# Altium project RoBeast_Control_Board.PrjPcb (part 3 of 4)

## Sheet RoBeast_Driver.SchDoc: Stepper Motor Drivers
size A4; ApprovedBy: CR; DrawnBy: VM & IG; Revision: V1; SheetNumber: 4; SheetTotal: 9
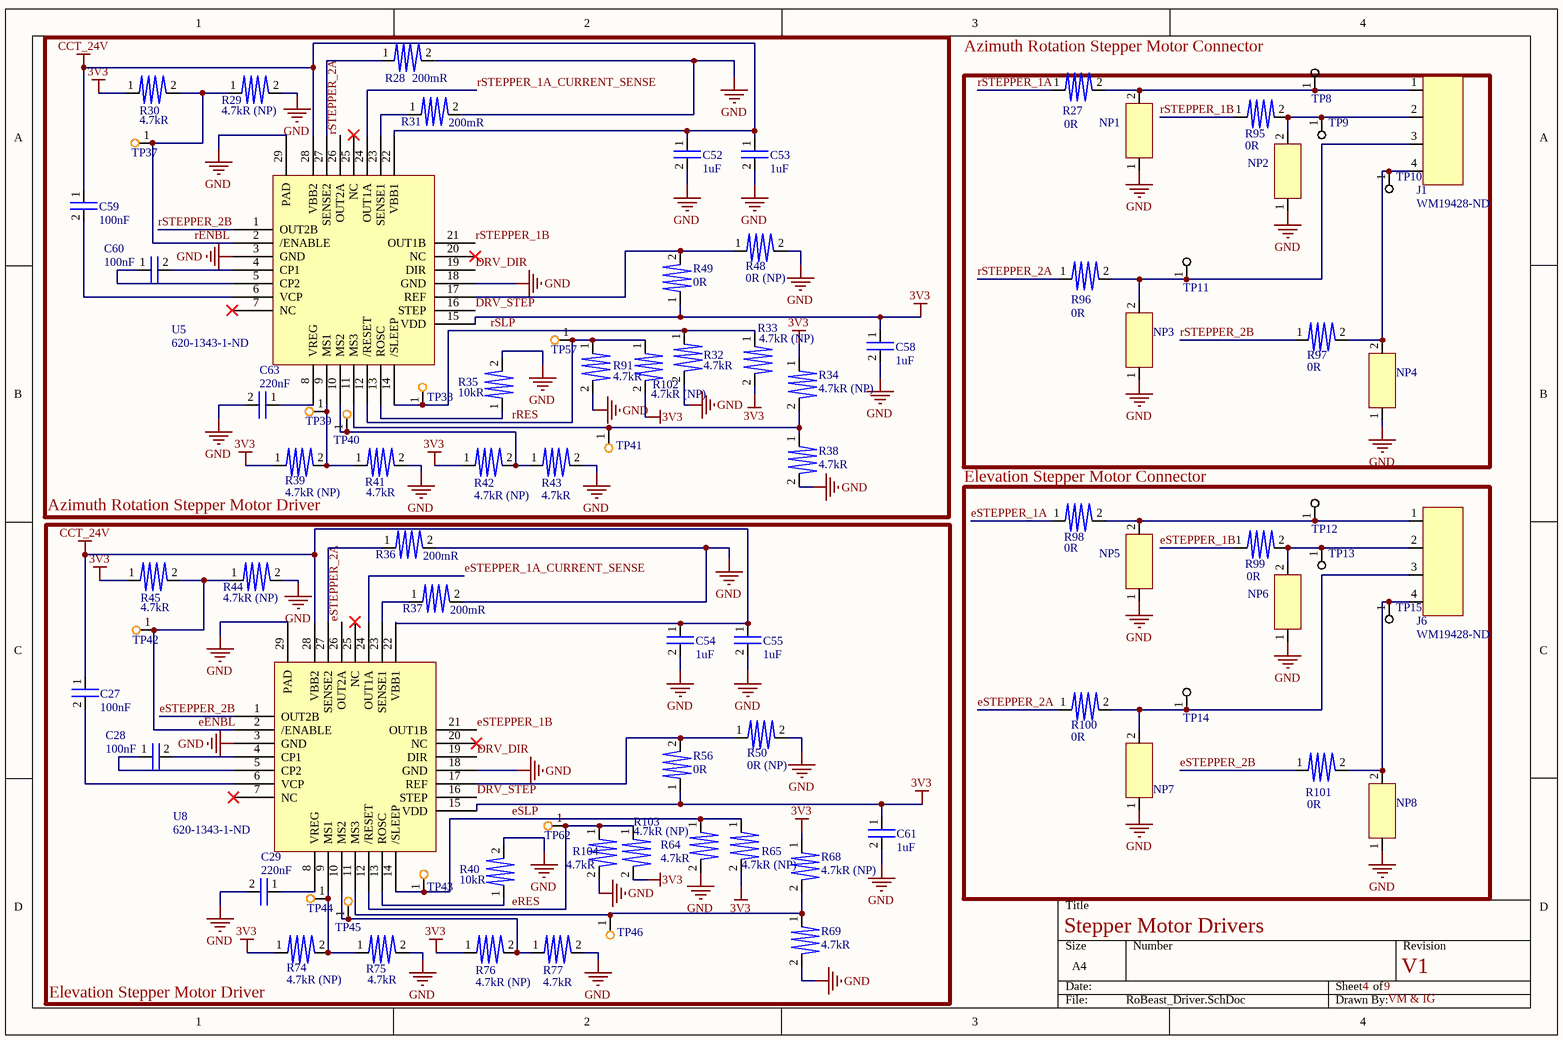
[diagram p3: RoBeast_Driver.SchDoc]

### Parts
C27  100nF  [0805]
C28  100nF  [0805]
C29  220nF  [0805]
C52  1uF  [0805]
C53  1uF  [0805]
C54  1uF  [0805]
C55  1uF  [0805]
C58  1uF  [0805]
C59  100nF  [0805]
C60  100nF  [0805]
C61  1uF  [0805]
C63  220nF  [0805]
J1  Supplier Part Number: WM19428-ND  [0015246043]  (hidden comment: 4 Pin Connector)
J6  Supplier Part Number: WM19428-ND  [0015246043]  (hidden comment: 4 Pin Connector)
NP1  Not Populated  [0805]  (value not drawn)
NP2  Not Populated  [0805]  (value not drawn)
NP3  Not Populated  [0805]  (value not drawn)
NP4  Not Populated  [0805]  (value not drawn)
NP5  Not Populated  [0805]  (value not drawn)
NP6  Not Populated  [0805]  (value not drawn)
NP7  Not Populated  [0805]  (value not drawn)
NP8  Not Populated  [0805]  (value not drawn)
R27  0R  [0805]
R28  200mR  [0805]
R29  4.7kR (NP)  [0805]
R30  4.7kR  [0805]
R31  200mR  [0805]
R32  4.7kR  [0805]
R33  4.7kR (NP)  [0805]
R34  4.7kR (NP)  [0805]
R35  10kR  [0805]
R36  200mR  [0805]
R37  200mR  [0805]
R38  4.7kR  [0805]
R39  4.7kR (NP)  [0805]
R40  10kR  [0805]
R41  4.7kR  [0805]
R42  4.7kR (NP)  [0805]
R43  4.7kR  [0805]
R44  4.7kR (NP)  [0805]
R45  4.7kR  [0805]
R48  0R (NP)  [0805]
R49  0R  [0805]
R50  0R (NP)  [0805]
R56  0R  [0805]
R64  4.7kR  [0805]
R65  4.7kR (NP)  [0805]
R68  4.7kR (NP)  [0805]
R69  4.7kR  [0805]
R74  4.7kR (NP)  [0805]
R75  4.7kR  [0805]
R76  4.7kR (NP)  [0805]
R77  4.7kR  [0805]
R91  4.7kR  [0805]
R95  0R  [0805]
R96  0R  [0805]
R97  0R  [0805]
R98  0R  [0805]
R99  0R  [0805]
R100  0R  [0805]
R101  0R  [0805]
R102  4.7kR (NP)  [0805]
R103  4.7kR (NP)  [0805]
R104  4.7kR  [0805]
TP8  Test Point  [RCWCTE]  (value not drawn)
TP9  Test Point  [RCWCTE]  (value not drawn)
TP10  Test Point  [RCWCTE]  (value not drawn)
TP11  Test Point  [RCWCTE]  (value not drawn)
TP12  Test Point  [RCWCTE]  (value not drawn)
TP13  Test Point  [RCWCTE]  (value not drawn)
TP14  Test Point  [RCWCTE]  (value not drawn)
TP15  Test Point  [RCWCTE]  (value not drawn)
TP37  Test Point  [Test Point]  (value not drawn)
TP38  Test Point  [Test Point]  (value not drawn)
TP39  Test Point  [Test Point]  (value not drawn)
TP40  Test Point  [Test Point]  (value not drawn)
TP41  Test Point  [Test Point]  (value not drawn)
TP42  Test Point  [Test Point]  (value not drawn)
TP43  Test Point  [Test Point]  (value not drawn)
TP44  Test Point  [Test Point]  (value not drawn)
TP45  Test Point  [Test Point]  (value not drawn)
TP46  Test Point  [Test Point]  (value not drawn)
TP57  Test Point  [Test Point]  (value not drawn)
TP62  Test Point  [Test Point]  (value not drawn)
U5  Supplier Part Number: 620-1343-1-ND  [A4988SETTR-T]  (hidden comment: Stepper Motor Driver)
U8  Supplier Part Number: 620-1343-1-ND  [A4988SETTR-T]  (hidden comment: Stepper Motor Driver)

### Blocks framed on the sheet
Azimuth Rotation Stepper Motor Driver: C52 C53 C58-C60 C63 R28-R35 R38 R39 R41-R43 R48 R49 R91 R102 TP37-TP41 TP57 U5
Azimuth Rotation Stepper Motor Connector: J1 NP1-NP4 R27 R95-R97 TP8-TP11
Elevation Stepper Motor Connector: J6 NP5-NP8 R98-R101 TP12-TP15

### Nets
3V3: C58.1 C61.1 R30.1 R33.2 R34.1 R39.1 R42.1 R45.1 R49.1 R56.1 R65.2 R68.1 R74.1 R76.1 R102.2 R103.2 U5.15(VDD) U8.15(VDD)
CCT_24V: C27.1 C52.1 C53.1 C54.1 C55.1 C59.1 U5.22(VBB1) U5.28(VBB2) U8.22(VBB1) U8.28(VBB2)
GND: C29.2 C52.2 C53.2 C54.2 C55.2 C58.2 C61.2 C63.2 NP1.1 NP2.1 NP3.1 NP4.1 NP5.1 NP6.1 NP7.1 NP8.1 R28.2 R29.2 R31.2 R32.2 R35.2 R36.2 R37.2 R38.2 R40.2 R41.2 R43.2 R44.2 R48.2 R50.2 R64.2 R69.2 R75.2 R77.2 R91.2 R104.2 U5.3(GND) U5.18(GND) U5.29(PAD) U8.3(GND) U8.18(GND) U8.29(PAD)
DRV_DIR: U5.19(DIR) U8.19(DIR)
DRV_STEP: U5.16(STEP) U8.16(STEP)
eENBL: R44.1 R45.2 TP42.1 U8.2(/ENABLE)
eRES: R103.1 R104.1 TP62.1 U8.12(/RESET)
eSLP: R64.1 R65.1 TP43.1 U8.14(/SLEEP)
eSTEPPER_1A: R98.1
eSTEPPER_1A_CURRENT_SENSE: U8.24(OUT1A)
eSTEPPER_1B: R99.1 U8.21(OUT1B)
eSTEPPER_2A: R100.1 U8.26(OUT2A)
eSTEPPER_2B: R101.1 U8.1(OUT2B)
rENBL: R29.1 R30.2 TP37.1 U5.2(/ENABLE)
rRES: R91.1 R102.1 TP57.1 U5.12(/RESET)
rSLP: R32.1 R33.1 TP38.1 U5.14(/SLEEP)
rSTEPPER_1A: R27.1
rSTEPPER_1A_CURRENT_SENSE: U5.24(OUT1A)
rSTEPPER_1B: R95.1 U5.21(OUT1B)
rSTEPPER_2A: R96.1 U5.26(OUT2A)
rSTEPPER_2B: R97.1 U5.1(OUT2B)
NetC27_2: C27.2 U8.6(VCP)
NetC28_1: C28.1 U8.5(CP2)
NetC28_2: C28.2 U8.4(CP1)
NetC29_1: C29.1 U8.8(VREG)
NetC59_2: C59.2 U5.6(VCP)
NetC60_1: C60.1 U5.5(CP2)
NetC60_2: C60.2 U5.4(CP1)
NetC63_1: C63.1 U5.8(VREG)
NetJ1_1: J1.1 NP1.2 R27.2 TP8.1
NetJ1_2: J1.2 NP2.2 R95.2 TP9.1
NetJ1_3: J1.3 NP3.2 R96.2 TP11.1
NetJ1_4: J1.4 NP4.2 R97.2 TP10.1
NetJ6_1: J6.1 NP5.2 R98.2 TP12.1
NetJ6_2: J6.2 NP6.2 R99.2 TP13.1
NetJ6_3: J6.3 NP7.2 R100.2 TP14.1
NetJ6_4: J6.4 NP8.2 R101.2 TP15.1
NetR28_1: R28.1 U5.27(SENSE2)
NetR31_1: R31.1 U5.23(SENSE1)
NetR34_2: R34.2 R38.1 TP41.1 U5.11(MS3)
NetR35_1: R35.1 U5.13(ROSC)
NetR36_1: R36.1 U8.27(SENSE2)
NetR37_1: R37.1 U8.23(SENSE1)
NetR39_2: R39.2 R41.1 TP39.1 U5.9(MS1)
NetR40_1: R40.1 U8.13(ROSC)
NetR42_2: R42.2 R43.1 TP40.1 U5.10(MS2)
NetR48_1: R48.1 R49.2 U5.17(REF)
NetR50_1: R50.1 R56.2 U8.17(REF)
NetR68_2: R68.2 R69.1 TP46.1 U8.11(MS3)
NetR74_2: R74.2 R75.1 TP44.1 U8.9(MS1)
NetR76_2: R76.2 R77.1 TP45.1 U8.10(MS2)

Not connected (* = marked no-connect by the designer): U5 7(NC)* 20(NC)* 25(NC)*; U8 7(NC)* 20(NC)* 25(NC)*

### Notes on the sheet
- (near R74) Elevation Stepper Motor Driver

### Library data of the parts
C27 C28 C59 C60 = C0805C104J5RAC7800: Ceramic Capacitor, Multilayer, Ceramic, 50V, 5% +Tol, 5% -Tol, X7R, 15% TC, 0.1uF, Surface Mount, 0805; Manufacturer: KEMET; Manufacturer Part Number: C0805C104J5RACTU; Multilayer: Yes; Supplier 1: Digikey; RoHS: Yes; Category: Ceramic Capacitors; Stock 1: 605061; Pricing 1: 1=0.18, 10=0.122, 50=0.0732, 100=0.0576, 500=0.04252, 1000=0.03519 (USD); Mount: Surface Mount; Number of Pins: 2; Dielectric Material: Ceramic; Package Shape: Rectangular; Size Code: 0805; Terminal Finish: Nickel; Min Operating Temperature: -55°C; Max Operating Temperature: 125°C; JESD-609 Code: e3; Capacitor Type: Ceramic; Negative Tolerance: 5%; Packaging: Tape and Reel; Positive Tolerance: 5%; Rated DC Voltage (URdc): 50V; Temperature Characteristics Code: X7R; Termination: Wraparound; Reach SVHC Compliant: Yes; RoHS Compliant: Yes; ComponentLink1URL: http://capacitoredge.kemet.com:80/capedge2/intellispec.jsp?pn=C0805C104J5RACTU&displayPN=C0805C104J5RACTU&src-supplier=IHS+Markit; ComponentLink1Description: http://capacitoredge.kemet.com:80/capedge2/intellispec.jsp?pn=C0805C104J5RACTU&displayPN=C0805C104J5RACTU&src-supplier=IHS+Markit; ComponentLink2URL: https://datasheet.ciiva.com/7842/1732721-7842179.pdf?src-supplier=Element14; ComponentLink2Description: https://datasheet.ciiva.com/7842/1732721-7842179.pdf?src-supplier=Element14; ComponentLink3URL: https://datasheet.ciiva.com/28682/1851736-28682223.pdf?src-supplier=Element14; ComponentLink3Description: https://datasheet.ciiva.com/28682/1851736-28682223.pdf?src-supplier=Element14; ComponentLink4URL: https://datasheet.ciiva.com/7258/1828800-7258413.pdf?src-supplier=Newark; ComponentLink4Description: https://datasheet.ciiva.com/7258/1828800-7258413.pdf?src-supplier=Newark; ComponentLink5URL: https://datasheet.ciiva.com/14589/70095383-14589015.pdf?src-supplier=Allied+Electronics; ComponentLink5Description: https://datasheet.ciiva.com/14589/70095383-14589015.pdf?src-supplier=Allied+Electronics; ComponentLink6URL: https://datasheet.ciiva.com/5417/kem-c1002-x7r-smd-5417352.pdf?src-supplier=Mouser; ComponentLink6Description: https://datasheet.ciiva.com/5417/kem-c1002-x7r-smd-5417352.pdf?src-supplier=Mouser; ComponentLink7URL: https://datasheet.ciiva.com/39122/docfinderpartnumberc0402c102k5ractu-39122924.pdf?src-supplier=Onlinecomponents.com; ComponentLink7Description: https://datasheet.ciiva.com/39122/docfinderpartnumberc0402c102k5ractu-39122924.pdf?src-supplier=Onlinecomponents.com; Supplier Part Number 1: 399-C0805C104J5RAC7800CT-ND; Capacitance: 100nF
C29 C63 = C0805C224J1RECAUTO: Ceramic Capacitor, Multilayer, Ceramic, 100V, 5% +Tol, 5% -Tol, X7R, 15% TC, 0.22uF, Surface Mount, 0805; Manufacturer: KEMET; Supplier 1: Digikey; Manufacturer Part Number: C0805C224J1RECAUTO; RoHS: Yes; Category: Ceramic Capacitors; Stock 1: 3363; Pricing 1: 1=0.32, 10=0.207, 50=0.145, 100=0.1171, 500=0.08702, 1000=0.07614 (USD); Number of Pins: 2; Dielectric Material: Ceramic; Capacitor Type: Ceramic; Reach SVHC Compliant: Yes; RoHS Compliant: Yes; ComponentLink1URL: https://datasheet.ciiva.com:443/pdfs/VipMasterIC/IC/KEME/KEME-S-A0008958450/KEME-S-A0008958450-1.pdf?src-supplier=IHS+Markit; ComponentLink1Description: https://datasheet.ciiva.com:443/pdfs/VipMasterIC/IC/KEME/KEME-S-A0008958450/KEME-S-A0008958450-1.pdf?src-supplier=IHS+Markit; ComponentLink2URL: https://api.kemet.com/component-edge/download/datasheet/C0805C224J1RECAUTO.pdf?src-supplier=Digikey; ComponentLink2Description: https://api.kemet.com/component-edge/download/datasheet/C0805C224J1RECAUTO.pdf?src-supplier=Digikey; Supplier Part Number 1: 399-C0805C224J1RECAUTOCT-ND
C52-C55 C58 C61 = CC0805JKX7R9BB105: Ceramic Capacitor, Multilayer, Ceramic, 50V, 5% +Tol, 5% -Tol, X7R, 15% TC, 1uF, Surface Mount, 0805; Manufacturer: Yageo; Supplier 1: Digikey; Manufacturer Part Number: CC0805JKX7R9BB105; RoHS: Yes; Category: Ceramic Capacitors; Stock 1: 50247; Pricing 1: 1=0.32, 10=0.207, 50=0.1454, 100=0.1174, 500=0.08724, 1000=0.07633 (USD); ComponentLink1URL: https://datasheet.ciiva.com:443/pdfs/VipMasterIC/IC/YAGO/YAGO-S-A0003557223/YAGO-S-A0003557223-1.pdf?src-supplier=IHS+Markit; ComponentLink1Description: https://datasheet.ciiva.com:443/pdfs/VipMasterIC/IC/YAGO/YAGO-S-A0003557223/YAGO-S-A0003557223-1.pdf?src-supplier=IHS+Markit; ComponentLink2URL: http://www.yageo.com/documents/recent/UPY-GPHC_X7R_6.3V-to-50V_18.pdf?src-supplier=Digikey; ComponentLink2Description: http://www.yageo.com/documents/recent/UPY-GPHC_X7R_6.3V-to-50V_18.pdf?src-supplier=Digikey; Supplier Part Number 1: 311-3498-1-ND
J1 J6 = 0015246043: Rectangular Power Connector, 4 Contact(s), Male, Solder Terminal, Receptacle; Manufacturer: Molex; Manufacturer Series: 42404; Connector Type: Power,Rectangular; Option: General Purpose; Empty Shell: No; Mating Information: MULTIPLE MATING PARTS AVAILABLE; Number of Contacts: 4; Contact Style: SQ PIN-SKT; Insertion Force-Max: 14.6784N; Number Of Connectors: 1; Number of Rows Loaded: 2; Body Breadth: 0.591inch; Body Depth: 0.815inch; Mounting Option 1: GUIDE SLOT; Reference Standard: UL; Reliability: COMMERCIAL; Contact Resistance: 10mR; Insulation Resistance: 1GR; Withdrawl Force-Min: 1.0008N; Board Mounting Option: SPLIT BOARD LOCK; Dielectric Withstanding Voltage (AC): 2.2kV; Durability: 30Cycles; Polarization Key: POLARIZED HOUSING; Rated Current (Signal): 8A; Mating Contact Pitch: 0.165inch; Mounting Option 2: LOCKING; PCB Contact Row Spacing: 5.5118mm; Plating Thickness: 30uin; Manufacturer Part Number: 15-24-6043; RoHS: Yes; Category: Headers and Wire Housings; Contact Finish - Mating: NOT SPECIFIED; Shell Material: POLYAMIDE66; Insulation Color: Natural; Insulation Material: Nylon; Contact Gender: Male; Filter Feature: No; Mixed Contacts: No; Termination: Solder; Body/Shell Style: RECEPTACLE; Mounting Style: RIGHT ANGLE; Flammability Rating: UL94 V-0; Reach SVHC Compliant: Yes; RoHS Compliant: Yes; DIN Conformance: No; IEC Conformance: No; MIL Conformance: No; ComponentLink1URL: https://datasheet.ciiva.com:443/pdfs/VipMasterIC/IC/MOLE/MOLES39673/MOLES39673-1.pdf?src-supplier=IHS+Markit; ComponentLink1Description: https://datasheet.ciiva.com:443/pdfs/VipMasterIC/IC/MOLE/MOLES39673/MOLES39673-1.pdf?src-supplier=IHS+Markit; ComponentLink2URL: https://datasheet.ciiva.com/16095/789440015246043-pcb-headers-16095349.pdf?src-supplier=Onlinecomponents.com; ComponentLink2Description: https://datasheet.ciiva.com/16095/789440015246043-pcb-headers-16095349.pdf?src-supplier=Onlinecomponents.com; ComponentLink3URL: https://datasheet.ciiva.com/30160/0015246043-pcb-headers-30160175.pdf?src-supplier=Onlinecomponents.com; ComponentLink3Description: https://datasheet.ciiva.com/30160/0015246043-pcb-headers-30160175.pdf?src-supplier=Onlinecomponents.com; Supplier: Digikey; Stock: 3180; Pricing: 1=2.55, 10=2.244, 880=1.78517, 1760=1.42814, 5280=1.32613 (USD); Mounting Technology: Board; Min Operating Temperature: -40°C; Max Operating Temperature: 105°C; Contact Pattern: RECTANGULAR; Number Of PCB Rows: 2; PCB Contact Pattern: RECTANGULAR; Mating Contact Row Spacing: 0.165inch; Terminal Length: 0.13inch; Terminal Pitch: 4.191mm
NP1-NP8 = NP
R27 R48-R50 R56 R95-R101 = RMCF0805ZT0R00: Fixed Resistor, Metal Glaze/thick Film, 0.125W, 0ohm, Surface Mount, 0805; Manufacturer: Stackpole Electronics; Rated Power Dissipation (P): 125mW; Rated Temperature: 70°C; Working Voltage: 150V; Package Height: 0.5mm; Package Length: 2mm; Package Width: 1.25mm; Reference Standard: AEC-Q200; Supplier 1: Digikey; Manufacturer Part Number: RMCF0805ZT0R00; RoHS: Yes; Category: Chip SMD Resistors; Stock 1: 1154169; Pricing 1: 1=0.1, 10=0.017, 25=0.0128, 50=0.0096, 100=0.0068, 250=0.00544, 500=0.00436, 1000=0.00321 (USD); Mount: Surface Mount; Number of Pins: 2; Package Shape: Rectangular; Size Code: 0805; Terminal Finish: Nickel; Min Operating Temperature: -55°C; Max Operating Temperature: 155°C; JESD-609 Code: e3; Resistor Type: FIXED RESISTOR; Construction: Rectangular; Package Style: SMTMeter; Packaging: Tape and Reel; Resistance: 0R; Technology: METAL GLAZE/THICK FILM; Termination: Wraparound; Reach SVHC Compliant: Yes; RoHS Compliant: Yes; ComponentLink1URL: https://datasheet.ciiva.com:443/pdfs/VipMasterIC/IC/SEIE/SEIE-S-A0007077258/SEIE-S-A0007077258-1.pdf?src-supplier=IHS+Markit; ComponentLink1Description: https://datasheet.ciiva.com:443/pdfs/VipMasterIC/IC/SEIE/SEIE-S-A0007077258/SEIE-S-A0007077258-1.pdf?src-supplier=IHS+Markit; ComponentLink2URL: https://datasheet.ciiva.com/15193/getdatasheetpartid-360417-15193658.pdf?src-supplier=Verical; ComponentLink2Description: https://datasheet.ciiva.com/15193/getdatasheetpartid-360417-15193658.pdf?src-supplier=Verical; Supplier Part Number 1: RMCF0805ZT0R00CT-ND
R28 R31 R36 R37 = D1WEL0805CR200F-T5: Res 0805 50PPM 0.2 Ohm 1.0% 0.75; Manufacturer: Thin Film Tech; Supplier 1: Digikey; Manufacturer Part Number: D1WEL0805CR200F-T5; RoHS: No; Category: Chip SMD Resistors; Stock 1: 11324; Pricing 1: 1=0.46, 10=0.337, 25=0.2704, 50=0.2008, 100=0.1417, 250=0.1262, 500=0.10818, 1000=0.08242 (USD); Supplier Part Number 1: 4463-D1WEL0805CR200F-T5CT-ND
R29 R30 R32-R34 R38 R39 R41-R45 R64 R65 R68 R69 R74-R77 R91 R102-R104 = RCC08054K70FKEA: Fixed Resistor, Metal Glaze/thick Film, 0.25W, 4700ohm, 200V, 1% +/-Tol, 100ppm/Cel, Surface Mount, 0805; Manufacturer: Vishay Dale; Supplier 1: Digikey; Manufacturer Part Number: RCC08054K70FKEA; RoHS: Yes; Category: Chip SMD Resistors; Stock 1: 96612; Pricing 1: 1=0.15, 10=0.069, 50=0.0454, 100=0.0385, 500=0.0271, 1000=0.0236 (USD); Supplier Part Number 1: 541-RCC08054K70FKEACT-ND
R35 R40 = RMCF0805FT10K0: Fixed Resistor, Metal Glaze/thick Film, 0.125W, 10000ohm, 150V, 1% +/-Tol, 100ppm/Cel, Surface Mount, 0805; Manufacturer: Stackpole Electronics; Rated Power Dissipation (P): 125mW; Rated Temperature: 70°C; Temperature Coefficient: 100ppm/°C; Package Height: 0.5mm; Package Length: 2mm; Package Width: 1.25mm; Reference Standard: AEC-Q200; Supplier 1: Digikey; Manufacturer Part Number: RMCF0805FT10K0; RoHS: Yes; Category: Chip SMD Resistors; Stock 1: 3602197; Pricing 1: 1=0.1, 10=0.02, 50=0.0124, 100=0.0103, 500=0.007, 1000=0.00601 (USD); Mount: Surface Mount; Number of Pins: 2; Package Shape: Rectangular; Size Code: 0805; Terminal Finish: Nickel; Min Operating Temperature: -55°C; Max Operating Temperature: 155°C; Tolerance: 1%; JESD-609 Code: e3; Resistor Type: FIXED RESISTOR; Construction: Rectangular; Package Style: SMTMeter; Packaging: Tape and Reel; Resistance: 10kR; Technology: METAL GLAZE/THICK FILM; Termination: Wraparound; Working Voltage: 150V; Reach SVHC Compliant: Yes; RoHS Compliant: Yes; ComponentLink1URL: https://datasheet.ciiva.com:443/pdfs/VipMasterIC/IC/SEIE/SEIE-S-A0009541969/SEIE-S-A0009541969-1.pdf?src-supplier=IHS+Markit; ComponentLink1Description: https://datasheet.ciiva.com:443/pdfs/VipMasterIC/IC/SEIE/SEIE-S-A0009541969/SEIE-S-A0009541969-1.pdf?src-supplier=IHS+Markit; ComponentLink2URL: https://datasheet.ciiva.com/15193/getdatasheetpartid-362046-15193525.pdf?src-supplier=Verical; ComponentLink2Description: https://datasheet.ciiva.com/15193/getdatasheetpartid-362046-15193525.pdf?src-supplier=Verical; Supplier Part Number 1: RMCF0805FT10K0CT-ND
TP8-TP15 = RCWCTE: Testing/Accessories; Manufacturer: KOA Speer; Rated Temperature: 70°C; Resistance: 0R; Package Height: 2mm; Package Length: 3.2mm; Package Width: 1.6mm; Reference Standard: AEC-Q200; Supplier 1: Digikey; Manufacturer Part Number: RCWCTE; RoHS: Yes; Category: Chip SMD Resistors; Stock 1: 132357; Pricing 1: 1=0.16, 10=0.137, 25=0.1212, 50=0.1132, 100=0.105, 250=0.09292, 500=0.08888, 1000=0.07272 (USD); Mount: Surface Mount; Number of Pins: 2; Package Shape: Rectangular; Size Code: 1206; Terminal Finish: Copper; Min Operating Temperature: -55°C; Max Operating Temperature: 125°C; JESD-609 Code: e2; Resistor Type: FIXED RESISTOR; Construction: Chip; Package Style: SMTMeter; Packaging: Tape and Reel; Termination: Wraparound; Reach SVHC Compliant: Yes; RoHS Compliant: Yes; ComponentLink1URL: https://datasheet.ciiva.com:443/pdfs/VipMasterIC/IC/KOAS/KOASS03065/KOASS03065-1.pdf?src-supplier=IHS+Markit; ComponentLink1Description: https://datasheet.ciiva.com:443/pdfs/VipMasterIC/IC/KOAS/KOASS03065/KOASS03065-1.pdf?src-supplier=IHS+Markit; ComponentLink2URL: https://datasheet.ciiva.com/34302/1876186-34302940.pdf?src-supplier=Jameco; ComponentLink2Description: https://datasheet.ciiva.com/34302/1876186-34302940.pdf?src-supplier=Jameco; ComponentLink3URL: https://datasheet.ciiva.com/5556/rc-5556236.pdf?src-supplier=Mouser; ComponentLink3Description: https://datasheet.ciiva.com/5556/rc-5556236.pdf?src-supplier=Mouser; ComponentLink4URL: https://datasheet.ciiva.com/26821/getdatasheetpartid-110197-26821157.pdf?src-supplier=Verical; ComponentLink4Description: https://datasheet.ciiva.com/26821/getdatasheetpartid-110197-26821157.pdf?src-supplier=Verical; Supplier Part Number 1: 2019-RCWCTECT-ND
U5 U8 = A4988SETTR-T: Stepper Motor Controller, 2A, DMOS; Manufacturer: Allegro MicroSystems; Channels: 1; Power Supplies: 35V; Supply Current-Max (Isup): 8mA; Max Supply Voltage: 5.5V; Min Supply Voltage: 3V; Nominal Supply Voltage: 3.3V; Qualification Status: Not Qualified; Supplier: Digikey; Manufacturer Part Number: A4988SETTR-T; RoHS: Yes; Category: Motor Drivers; Stock: 34042; Pricing: 1=3.05, 10=2.74, 25=2.5908, 100=2.2452, 250=2.13008, 500=1.91132 (USD); Case/Package: HVQCCN; Pins: 28; Package Shape: Square; Terminal Finish: Tin; Min Operating Temperature: -20°C; Max Operating Temperature: 85°C; JESD-609 Code: e3; Throw Configuration: STEPPER MOTOR CONTROLLER; Moisture Sensitivity Level: 2; Max Output current: 2A; Package Style: CHIP CARRIER, HEAT SINK/SLUG, VERY THIN PROFILEMeter; Surface Mount: Yes; Technology: NMOS; Terminal Form: No Lead; Terminal Position: QUAD; Length: 5mm; Width: 5mm; Height - Seated (Max): 1mm; Terminal Pitch: 0.5mm; Temperature Grade: OTHER; Reach SVHC Compliant: Yes; RoHS Compliant: Yes; ComponentLink1URL: https://datasheet.ciiva.com:443/pdfs/VipMasterIC/IC/ALLE/ALLE-S-A0001477902/ALLE-S-A0001477902-1.pdf?src-supplier=IHS+Markit; ComponentLink1Description: https://datasheet.ciiva.com:443/pdfs/VipMasterIC/IC/ALLE/ALLE-S-A0001477902/ALLE-S-A0001477902-1.pdf?src-supplier=IHS+Markit; ComponentLink2URL: https://datasheet.ciiva.com/1147/1481258-1147170.pdf?src-supplier=Element14; ComponentLink2Description: https://datasheet.ciiva.com/1147/1481258-1147170.pdf?src-supplier=Element14; ComponentLink3URL: https://datasheet.ciiva.com/15109/getdatasheetpartid-557828-15109654.pdf?src-supplier=Verical; ComponentLink3Description: https://datasheet.ciiva.com/15109/getdatasheetpartid-557828-15109654.pdf?src-supplier=Verical; ComponentLink4URL: https://datasheet.ciiva.com/1608/a4988-datasheet-1608449.pdf?src-supplier=Newark; ComponentLink4Description: https://datasheet.ciiva.com/1608/a4988-datasheet-1608449.pdf?src-supplier=Newark; ComponentLink5URL: https://datasheet.ciiva.com/3229/a4988-datasheet-3229532.pdf?src-supplier=Avnet; ComponentLink5Description: https://datasheet.ciiva.com/3229/a4988-datasheet-3229532.pdf?src-supplier=Avnet

## Sheet RoBeast_Positional_Feedback.SchDoc: Positional Feedback
size A4; ApprovedBy: CR; DrawnBy: VM & IG; Revision: V1; SheetNumber: 5; SheetTotal: 9
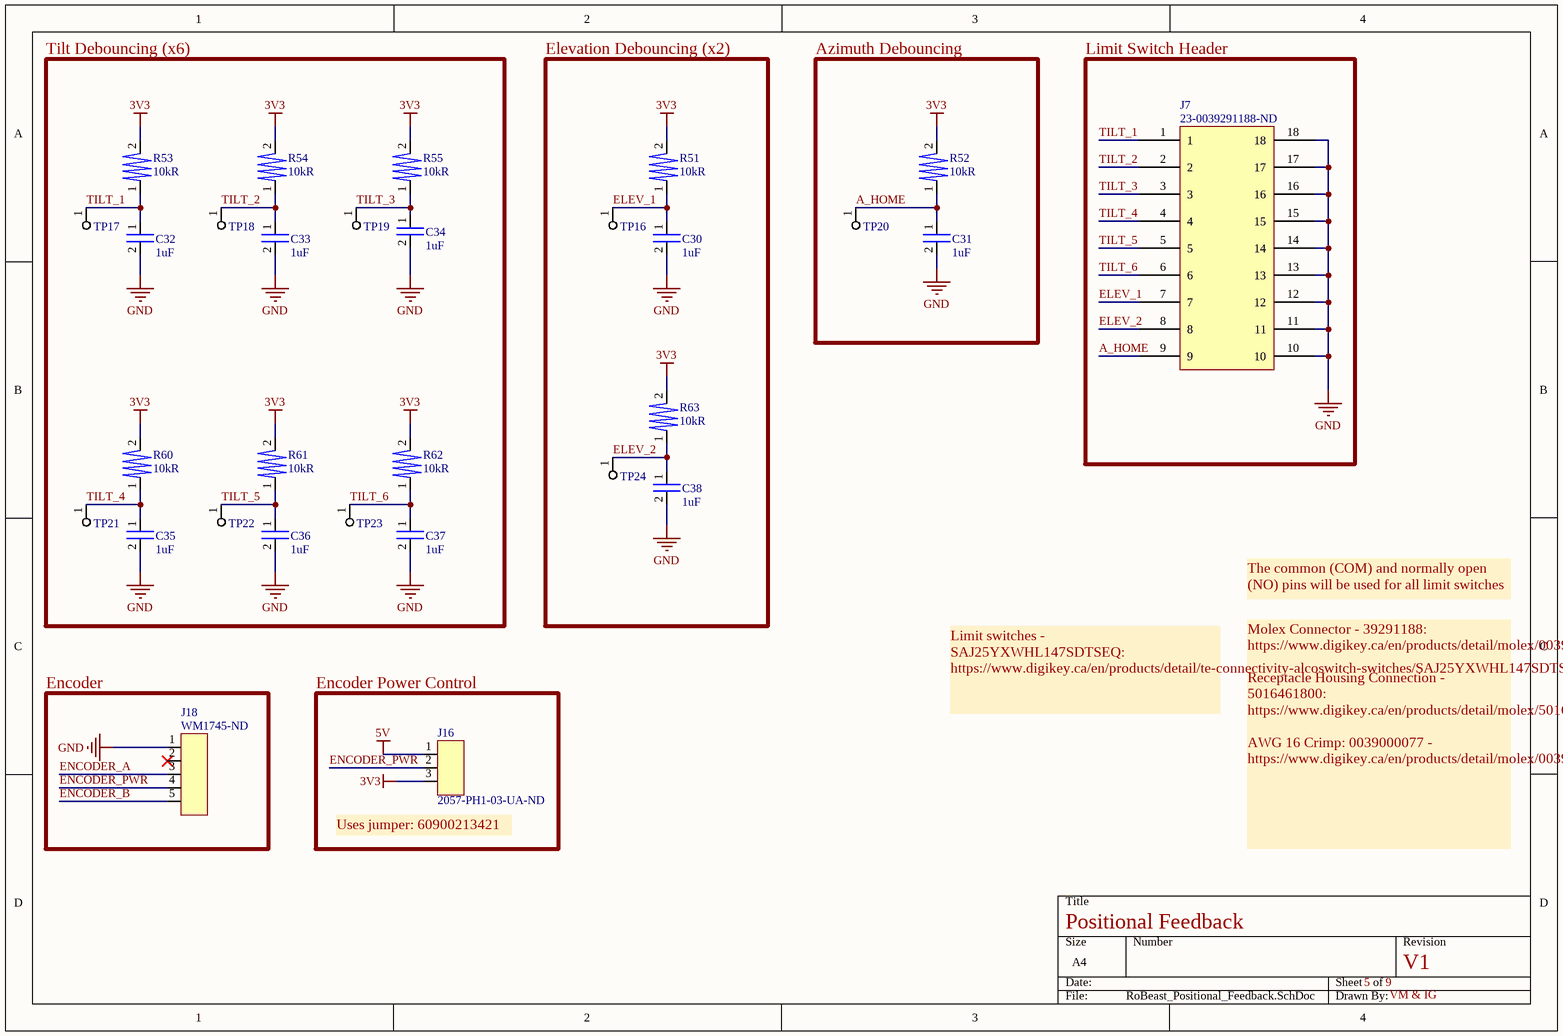
[diagram p4: RoBeast_Positional_Feedback.SchDoc]

### Parts
C30  1uF  [0805]
C31  1uF  [0805]
C32  1uF  [0805]
C33  1uF  [0805]
C34  1uF  [0805]
C35  1uF  [0805]
C36  1uF  [0805]
C37  1uF  [0805]
C38  1uF  [0805]
J7  Supplier Part Number 1: 23-0039291188-ND  [0039291188]  (hidden comment: 18 Pin Connector)
J16  Supplier Part Number 1: 2057-PH1-03-UA-ND  [PH1-03-UA]  (hidden comment: 3 Pin Connector)
J18  Supplier Part Number: WM1745-ND  [0530480510]  (hidden comment: 5 Pin Male Connector)
R51  10kR  [0805]
R52  10kR  [0805]
R53  10kR  [0805]
R54  10kR  [0805]
R55  10kR  [0805]
R60  10kR  [0805]
R61  10kR  [0805]
R62  10kR  [0805]
R63  10kR  [0805]
TP16  Test Point  [RCWCTE]  (value not drawn)
TP17  Test Point  [RCWCTE]  (value not drawn)
TP18  Test Point  [RCWCTE]  (value not drawn)
TP19  Test Point  [RCWCTE]  (value not drawn)
TP20  Test Point  [RCWCTE]  (value not drawn)
TP21  Test Point  [RCWCTE]  (value not drawn)
TP22  Test Point  [RCWCTE]  (value not drawn)
TP23  Test Point  [RCWCTE]  (value not drawn)
TP24  Test Point  [RCWCTE]  (value not drawn)

### Blocks framed on the sheet
Tilt Debouncing (x6): C32-C37 R53-R55 R60-R62 TP17-TP19 TP21-TP23
Elevation Debouncing (x2): C30 C38 R51 R63 TP16 TP24
Azimuth Debouncing: C31 R52 TP20
Limit Switch Header: J7
Encoder: J18
Encoder Power Control: J16

### Nets
3V3: J16.3 R51.2 R52.2 R53.2 R54.2 R55.2 R60.2 R61.2 R62.2 R63.2
5V: J16.1
GND: C30.2 C31.2 C32.2 C33.2 C34.2 C35.2 C36.2 C37.2 C38.2 J7.10 J7.11 J7.12 J7.13 J7.14 J7.15 J7.16 J7.17 J7.18 J18.1
A_HOME: C31.1 J7.9 R52.1 TP20.1
ELEV_1: C30.1 J7.7 R51.1 TP16.1
ELEV_2: C38.1 J7.8 R63.1 TP24.1
ENCODER_A: J18.3
ENCODER_B: J18.5
ENCODER_PWR: J16.2 J18.4
TILT_1: C32.1 J7.1 R53.1 TP17.1
TILT_2: C33.1 J7.2 R54.1 TP18.1
TILT_3: C34.1 J7.3 R55.1 TP19.1
TILT_4: C35.1 J7.4 R60.1 TP21.1
TILT_5: C36.1 J7.5 R61.1 TP22.1
TILT_6: C37.1 J7.6 R62.1 TP23.1

Not connected (* = marked no-connect by the designer): J18 2*

### Notes on the sheet
- The common (COM) and normally open (NO) pins will be used for all limit switches
- Limit switches - SAJ25YXWHL147SDTSEQ:
  https://www.digikey.ca/en/products/detail/te-connectivity-alcoswitch-switches/SAJ25YXWHL147SDTSEQ/11312233
- (near J16) Uses jumper: 60900213421
- Molex Connector - 39291188: https://www.digikey.ca/en/products/detail/molex/0039291188/356046
  Receptacle Housing Connection -  5016461800: https://www.digikey.ca/en/products/detail/molex/5016461800/1787763
  AWG 16 Crimp: 0039000077 - https://www.digikey.ca/en/products/detail/molex/0039000077/1643440

### Library data of the parts
C30-C38 = CC0805JKX7R9BB105: as C52 on sheet RoBeast_Driver; Supplier 1: Digikey; Manufacturer Part Number: CC0805JKX7R9BB105; RoHS: Yes; Category: Ceramic Capacitors; Stock 1: 50247; Pricing 1: 1=0.32, 10=0.207, 50=0.1454, 100=0.1174, 500=0.08724, 1000=0.07633 (USD); ComponentLink1URL: https://datasheet.ciiva.com:443/pdfs/VipMasterIC/IC/YAGO/YAGO-S-A0003557223/YAGO-S-A0003557223-1.pdf?src-supplier=IHS+Markit; ComponentLink1Description: https://datasheet.ciiva.com:443/pdfs/VipMasterIC/IC/YAGO/YAGO-S-A0003557223/YAGO-S-A0003557223-1.pdf?src-supplier=IHS+Markit; ComponentLink2URL: http://www.yageo.com/documents/recent/UPY-GPHC_X7R_6.3V-to-50V_18.pdf?src-supplier=Digikey; ComponentLink2Description: http://www.yageo.com/documents/recent/UPY-GPHC_X7R_6.3V-to-50V_18.pdf?src-supplier=Digikey; Supplier Part Number 1: 311-3498-1-ND
J7 = 0039291188: Rectangular Power Connector, 18 Contact(s), Male, Solder Terminal, Receptacle; Manufacturer: Molex; Connector Type: Power,Rectangular; Option: General Purpose; Board Mounting Option: MOUNTING FLANGE; Contact Resistance: 10mR; Contact Style: SQ PIN-SKT; Dielectric Withstanding Voltage (AC): 1.5kV; Durability: 30Cycles; Empty Shell: No; Insertion Force-Max: 6.672N; Insulation Resistance: 1GR; Mating Information: MULTIPLE MATING PARTS AVAILABLE; Number Of Connectors: 1; Number Of PCB Rows: 2; Polarization Key: POLARIZED HOUSING; Rated Current (Signal): 6A; Number of Contacts: 18; Withdrawl Force-Min: 3.1136N; Body Breadth: 0.394inch; Body Depth: 0.72inch; Body Length: 1.929inch; Mating Contact Pitch: 0.165inch; Mounting Option 1: POLARIZED LCK; Mounting Option 2: LOCKING; PCB Contact Row Spacing: 5.5118mm; Plating Thickness: 200uin; Reference Standard: UL; Reliability: COMMERCIAL; Supplier 1: Digikey; Manufacturer Part Number: 39-29-1188; RoHS: Yes; Category: Headers and Wire Housings; Stock 1: 8423; Pricing 1: 1=4.09, 10=3.6, 100=2.8634, 1000=2.37249 (USD); Mount: Board; Contact Finish - Mating: NOT SPECIFIED; Contact Finish - Termination: Tin (Sn) - with Nickel (Ni) barrier; Insulation Material: Nylon; Shell Material: Nylon; Min Operating Temperature: -40°C; Max Operating Temperature: 105°C; JESD-609 Code: e3; Body/Shell Style: RECEPTACLE; Contact Gender: Male; Contact Pattern: RECTANGULAR; Filter Feature: No; Mixed Contacts: No; Mounting Style: RIGHT ANGLE; Number of Rows Loaded: 2; PCB Contact Pattern: RECTANGULAR; Termination: Solder; Mating Contact Row Spacing: 0.165inch; Terminal Length: 0.138inch; Terminal Pitch: 4.191mm; Flammability Rating: UL94 V-2; DIN Conformance: No; IEC Conformance: No; MIL Conformance: No; Reach SVHC Compliant: Yes; RoHS Compliant: Yes; ComponentLink1URL: https://datasheet.ciiva.com:443/pdfs/VipMasterIC/IC/MOLE/MOLE-S-A0004635529/MOLE-S-A0004635529-1.pdf?src-supplier=IHS+Markit; ComponentLink1Description: https://datasheet.ciiva.com:443/pdfs/VipMasterIC/IC/MOLE/MOLE-S-A0004635529/MOLE-S-A0004635529-1.pdf?src-supplier=IHS+Markit; ComponentLink2URL: https://datasheet.ciiva.com/711/039291028-sd-711978.pdf?src-supplier=Digikey; ComponentLink2Description: https://datasheet.ciiva.com/711/039291028-sd-711978.pdf?src-supplier=Digikey; ComponentLink3URL: https://datasheet.ciiva.com/30097/128000039291188-pcb-headers-30097010.pdf?src-supplier=Onlinecomponents.com; ComponentLink3Description: https://datasheet.ciiva.com/30097/128000039291188-pcb-headers-30097010.pdf?src-supplier=Onlinecomponents.com; ComponentLink4URL: https://datasheet.ciiva.com/26916/getdatasheetpartid-310375-26916660.pdf?src-supplier=Verical; ComponentLink4Description: https://datasheet.ciiva.com/26916/getdatasheetpartid-310375-26916660.pdf?src-supplier=Verical; ComponentLink5URL: https://datasheet.ciiva.com/11748/0900766b8059542f-11748868.pdf?src-supplier=Rs; ComponentLink5Description: https://datasheet.ciiva.com/11748/0900766b8059542f-11748868.pdf?src-supplier=Rs; ComponentLink6URL: https://datasheet.ciiva.com/5158/0039291188-pcb-headers-228408-5158739.pdf?src-supplier=Mouser; ComponentLink6Description: https://datasheet.ciiva.com/5158/0039291188-pcb-headers-228408-5158739.pdf?src-supplier=Mouser; ComponentLink7URL: https://datasheet.ciiva.com/1442/1865038-1442913.pdf?src-supplier=Element14; ComponentLink7Description: https://datasheet.ciiva.com/1442/1865038-1442913.pdf?src-supplier=Element14
J16 = PH1-03-UA: Conn Unshrouded Header HDR 3 POS 2.54mm Solder ST Thru-Hole Bag; Manufacturer: Adam Equipment; Supplier 1: Digikey; Manufacturer Part Number: PH1-03-UA; RoHS: Yes; Category: Connectors; Stock 1: 50788; Pricing 1: 1=0.1, 10=0.045, 100=0.0285, 500=0.02374, 1000=0.02136, 5000=0.01804, 10000=0.01709 (USD); ComponentLink1URL: https://datasheet.ciiva.com/16396/catpg240-254-16396026.pdf?src-supplier=Future+Electronics; ComponentLink1Description: https://datasheet.ciiva.com/16396/catpg240-254-16396026.pdf?src-supplier=Future+Electronics
J18 = 0530480510: Board Connector, 5 Contact(s), 1 Row(s), Male, Right Angle, 0.049 inch Pitch, Solder Terminal, Locking, Natural Insulator, Receptacle; Manufacturer: Molex; Manufacturer Part Number: 53048-0510; Manufacturer Series: 53048; Option: General Purpose; Contact Pattern: RECTANGULAR; Contact Resistance: 20mR; Contact Style: SQ PIN-SKT; Filter Feature: No; Insulation Resistance: 100MR; Mating Information: MULTIPLE MATING PARTS AVAILABLE; Number Of Connectors: 1; Number of Contacts: 5; Body Breadth: 0.138inch; Body Depth: 0.217inch; Body Length: 0.315inch; Reliability: COMMERCIAL; Supplier: Digikey; RoHS: Yes; Category: Headers and Wire Housings; Stock: 61267; Pricing: 1=0.49, 10=0.414, 80=0.32175, 4000=0.22983, 8000=0.20684, 12000=0.20378 (USD); Mounting Technology: Board; Contact Finish - Mating: TIN; Contact Material: Bronze; Contact Finish - Termination: Tin (Sn); Insulation Color: Natural; Insulation Material: Nylon; Min Operating Temperature: -40°C; Max Operating Temperature: 85°C; Connector Type: BOARD CONNECTOR; JESD-609 Code: e3; Body/Shell Style: RECEPTACLE; Contact Gender: Male; Mixed Contacts: No; Mounting Style: RIGHT ANGLE; Number Of PCB Rows: 1; Number of Rows Loaded: 1; PCB Contact Pattern: RECTANGULAR; Termination: Solder; Mating Contact Pitch: 0.049inch; Mounting Option 1: LOCKING; Terminal Length: 0.091inch; Terminal Pitch: 1.25mm; Flammability Rating: UL94 V-0; Reach SVHC Compliant: Yes; RoHS Compliant: Yes; DIN Conformance: No; IEC Conformance: No; MIL Conformance: No; ComponentLink1URL: https://datasheet.ciiva.com:443/pdfs/VipMasterIC/IC/MOLE/MOLE-S-A0001318164/MOLE-S-A0001396416-1.pdf?src-supplier=IHS+Markit; ComponentLink1Description: https://datasheet.ciiva.com:443/pdfs/VipMasterIC/IC/MOLE/MOLE-S-A0001318164/MOLE-S-A0001396416-1.pdf?src-supplier=IHS+Markit
R51-R55 R60-R63 = RMCF0805FT10K0: as R35 on sheet RoBeast_Driver; Supplier 1: Digikey; Manufacturer Part Number: RMCF0805FT10K0; RoHS: Yes; Category: Chip SMD Resistors; Stock 1: 3602197; Pricing 1: 1=0.1, 10=0.02, 50=0.0124, 100=0.0103, 500=0.007, 1000=0.00601 (USD); Mount: Surface Mount; Number of Pins: 2; Package Shape: Rectangular; Size Code: 0805; Terminal Finish: Nickel; Min Operating Temperature: -55°C; Max Operating Temperature: 155°C; Tolerance: 1%; JESD-609 Code: e3; Resistor Type: FIXED RESISTOR; Construction: Rectangular; Package Style: SMTMeter; Packaging: Tape and Reel; Resistance: 10kR; Technology: METAL GLAZE/THICK FILM; Termination: Wraparound; Working Voltage: 150V; Reach SVHC Compliant: Yes; RoHS Compliant: Yes; ComponentLink1URL: https://datasheet.ciiva.com:443/pdfs/VipMasterIC/IC/SEIE/SEIE-S-A0009541969/SEIE-S-A0009541969-1.pdf?src-supplier=IHS+Markit; ComponentLink1Description: https://datasheet.ciiva.com:443/pdfs/VipMasterIC/IC/SEIE/SEIE-S-A0009541969/SEIE-S-A0009541969-1.pdf?src-supplier=IHS+Markit; ComponentLink2URL: https://datasheet.ciiva.com/15193/getdatasheetpartid-362046-15193525.pdf?src-supplier=Verical; ComponentLink2Description: https://datasheet.ciiva.com/15193/getdatasheetpartid-362046-15193525.pdf?src-supplier=Verical; Supplier Part Number 1: RMCF0805FT10K0CT-ND
TP16-TP24 = RCWCTE: as TP8 on sheet RoBeast_Driver; Supplier 1: Digikey; Manufacturer Part Number: RCWCTE; RoHS: Yes; Category: Chip SMD Resistors; Stock 1: 132357; Pricing 1: 1=0.16, 10=0.137, 25=0.1212, 50=0.1132, 100=0.105, 250=0.09292, 500=0.08888, 1000=0.07272 (USD); Mount: Surface Mount; Number of Pins: 2; Package Shape: Rectangular; Size Code: 1206; Terminal Finish: Copper; Min Operating Temperature: -55°C; Max Operating Temperature: 125°C; JESD-609 Code: e2; Resistor Type: FIXED RESISTOR; Construction: Chip; Package Style: SMTMeter; Packaging: Tape and Reel; Termination: Wraparound; Reach SVHC Compliant: Yes; RoHS Compliant: Yes; ComponentLink1URL: https://datasheet.ciiva.com:443/pdfs/VipMasterIC/IC/KOAS/KOASS03065/KOASS03065-1.pdf?src-supplier=IHS+Markit; ComponentLink1Description: https://datasheet.ciiva.com:443/pdfs/VipMasterIC/IC/KOAS/KOASS03065/KOASS03065-1.pdf?src-supplier=IHS+Markit; ComponentLink2URL: https://datasheet.ciiva.com/34302/1876186-34302940.pdf?src-supplier=Jameco; ComponentLink2Description: https://datasheet.ciiva.com/34302/1876186-34302940.pdf?src-supplier=Jameco; ComponentLink3URL: https://datasheet.ciiva.com/5556/rc-5556236.pdf?src-supplier=Mouser; ComponentLink3Description: https://datasheet.ciiva.com/5556/rc-5556236.pdf?src-supplier=Mouser; ComponentLink4URL: https://datasheet.ciiva.com/26821/getdatasheetpartid-110197-26821157.pdf?src-supplier=Verical; ComponentLink4Description: https://datasheet.ciiva.com/26821/getdatasheetpartid-110197-26821157.pdf?src-supplier=Verical; Supplier Part Number 1: 2019-RCWCTECT-ND

## Sheet RoBeast_Power_Linear.SchDoc: Power (Linear Regulator)
size A; ApprovedBy: CR; DrawnBy: VM & IG; Revision: V1; SheetNumber: 6; SheetTotal: 9
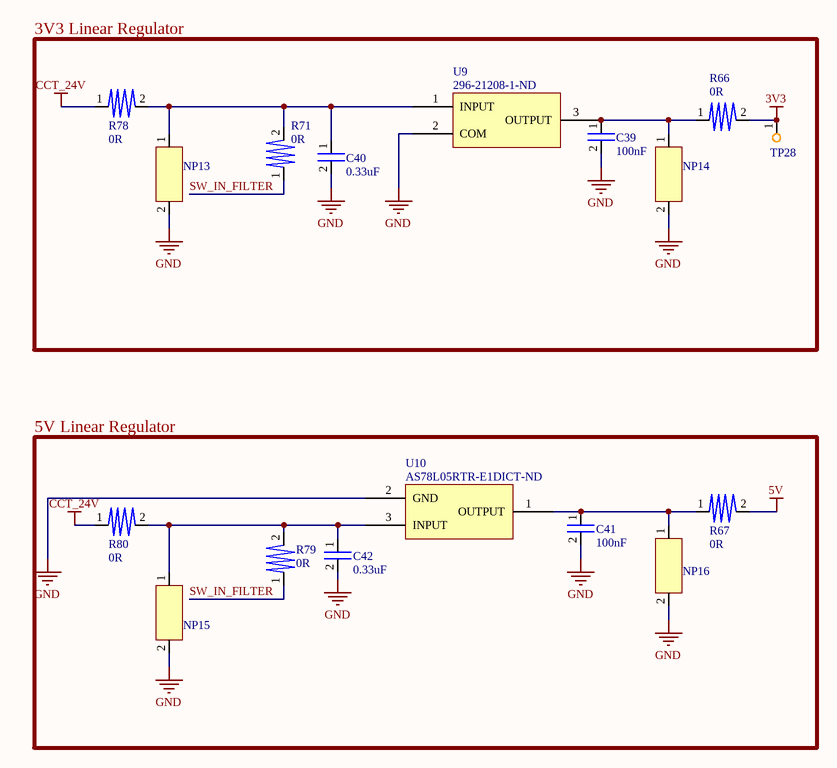
[diagram p5: RoBeast_Power_Linear.SchDoc]

### Parts
C39  100nF  [0805]
C40  0.33uF  [0805]
C41  100nF  [0805]
C42  0.33uF  [0805]
NP13  Not Populated  [0805]  (value not drawn)
NP14  Not Populated  [0805]  (value not drawn)
NP15  Not Populated  [0805]  (value not drawn)
NP16  Not Populated  [0805]  (value not drawn)
R66  0R  [0805]
R67  0R  [0805]
R71  0R  [0805]
R78  0R  [0805]
R79  0R  [0805]
R80  0R  [0805]
TP28  Test Point  [Test Point]  (value not drawn)
U9  Supplier Part Number 1: 296-21208-1-ND  [UA78M33CKVURG3]  (hidden comment: Fixed 3V3 Voltage Regulator)
U10  Supplier Part Number 1: AS78L05RTR-E1DICT-ND  [AS78L05RTR-E1]  (hidden comment: Fixed 5V Linear Regulator)

### Blocks framed on the sheet
3V3 Linear Regulator: C39 C40 NP13 NP14 R66 R71 R78 TP28 U9
5V Linear Regulator: C41 C42 NP15 NP16 R67 R79 R80 U10

### Nets
3V3: R66.2 TP28.1
5V: R67.2
CCT_24V: R78.1 R80.1
GND: C39.2 C40.2 C41.2 C42.2 NP13.2 NP14.2 NP15.2 NP16.2 U9.2(COM) U10.2(GND)
SW_IN_FILTER: R71.1 R79.1
NetC39_1: C39.1 NP14.1 R66.1 U9.3(OUTPUT)
NetC40_1: C40.1 NP13.1 R71.2 R78.2 U9.1(INPUT)
NetC41_1: C41.1 NP16.1 R67.1 U10.1(OUTPUT)
NetC42_1: C42.1 NP15.1 R79.2 R80.2 U10.3(INPUT)

### Library data of the parts
C39 C41 = C0805C104J5RAC7800: as C27 on sheet RoBeast_Driver; Supplier 1: Digikey; RoHS: Yes; Category: Ceramic Capacitors; Stock 1: 605061; Pricing 1: 1=0.18, 10=0.122, 50=0.0732, 100=0.0576, 500=0.04252, 1000=0.03519 (USD); Mount: Surface Mount; Number of Pins: 2; Dielectric Material: Ceramic; Package Shape: Rectangular; Size Code: 0805; Terminal Finish: Nickel; Min Operating Temperature: -55°C; Max Operating Temperature: 125°C; JESD-609 Code: e3; Capacitor Type: Ceramic; Negative Tolerance: 5%; Packaging: Tape and Reel; Positive Tolerance: 5%; Rated DC Voltage (URdc): 50V; Temperature Characteristics Code: X7R; Termination: Wraparound; Reach SVHC Compliant: Yes; RoHS Compliant: Yes; ComponentLink1URL: http://capacitoredge.kemet.com:80/capedge2/intellispec.jsp?pn=C0805C104J5RACTU&displayPN=C0805C104J5RACTU&src-supplier=IHS+Markit; ComponentLink1Description: http://capacitoredge.kemet.com:80/capedge2/intellispec.jsp?pn=C0805C104J5RACTU&displayPN=C0805C104J5RACTU&src-supplier=IHS+Markit; ComponentLink2URL: https://datasheet.ciiva.com/7842/1732721-7842179.pdf?src-supplier=Element14; ComponentLink2Description: https://datasheet.ciiva.com/7842/1732721-7842179.pdf?src-supplier=Element14; ComponentLink3URL: https://datasheet.ciiva.com/28682/1851736-28682223.pdf?src-supplier=Element14; ComponentLink3Description: https://datasheet.ciiva.com/28682/1851736-28682223.pdf?src-supplier=Element14; ComponentLink4URL: https://datasheet.ciiva.com/7258/1828800-7258413.pdf?src-supplier=Newark; ComponentLink4Description: https://datasheet.ciiva.com/7258/1828800-7258413.pdf?src-supplier=Newark; ComponentLink5URL: https://datasheet.ciiva.com/14589/70095383-14589015.pdf?src-supplier=Allied+Electronics; ComponentLink5Description: https://datasheet.ciiva.com/14589/70095383-14589015.pdf?src-supplier=Allied+Electronics; ComponentLink6URL: https://datasheet.ciiva.com/5417/kem-c1002-x7r-smd-5417352.pdf?src-supplier=Mouser; ComponentLink6Description: https://datasheet.ciiva.com/5417/kem-c1002-x7r-smd-5417352.pdf?src-supplier=Mouser; ComponentLink7URL: https://datasheet.ciiva.com/39122/docfinderpartnumberc0402c102k5ractu-39122924.pdf?src-supplier=Onlinecomponents.com; ComponentLink7Description: https://datasheet.ciiva.com/39122/docfinderpartnumberc0402c102k5ractu-39122924.pdf?src-supplier=Onlinecomponents.com; Supplier Part Number 1: 399-C0805C104J5RAC7800CT-ND; Capacitance: 100nF
C40 C42 = C0805C334K5RAC7800: Ceramic Capacitor, Multilayer, Ceramic, 50V, 10% +Tol, 10% -Tol, X7R, 15% TC, 0.33uF, Surface Mount, 0805; Manufacturer: KEMET; Manufacturer Part Number: C0805C334K5RACTU; Capacitance: 330nF; Multilayer: Yes; Supplier 1: Digikey; RoHS: Yes; Category: Ceramic Capacitors; Stock 1: 50949; Pricing 1: 1=0.16, 10=0.111, 50=0.0662, 100=0.0521, 500=0.0385, 1000=0.03188 (USD); Mount: Surface Mount; Number of Pins: 2; Dielectric Material: Ceramic; Package Shape: Rectangular; Size Code: 0805; Terminal Finish: Nickel; Min Operating Temperature: -55°C; Max Operating Temperature: 125°C; JESD-609 Code: e3; Capacitor Type: Ceramic; Negative Tolerance: 10%; Packaging: Tape and Reel; Positive Tolerance: 10%; Rated DC Voltage (URdc): 50V; Temperature Characteristics Code: X7R; Termination: Wraparound; Manufacturer Series: C0805C334K5RACTU; Reach SVHC Compliant: Yes; RoHS Compliant: Yes; ComponentLink1URL: http://capacitoredge.kemet.com:80/capedge2/DataSheet/Datasheet-C0805C334K5RAC7800.pdf?pn=C0805C334K5RAC7800&src-supplier=IHS+Markit; ComponentLink1Description: http://capacitoredge.kemet.com:80/capedge2/DataSheet/Datasheet-C0805C334K5RAC7800.pdf?pn=C0805C334K5RAC7800&src-supplier=IHS+Markit; ComponentLink2URL: https://datasheet.ciiva.com/28608/1851736-28608437.pdf?src-supplier=Element14; ComponentLink2Description: https://datasheet.ciiva.com/28608/1851736-28608437.pdf?src-supplier=Element14; ComponentLink3URL: https://datasheet.ciiva.com/28696/1851736-28696038.pdf?src-supplier=Element14; ComponentLink3Description: https://datasheet.ciiva.com/28696/1851736-28696038.pdf?src-supplier=Element14; ComponentLink4URL: https://datasheet.ciiva.com/18193/getdatasheetpartid-385729-18193783.pdf?src-supplier=Verical; ComponentLink4Description: https://datasheet.ciiva.com/18193/getdatasheetpartid-385729-18193783.pdf?src-supplier=Verical; ComponentLink5URL: https://datasheet.ciiva.com/18193/getdatasheetpartid-93202-18193786.pdf?src-supplier=Verical; ComponentLink5Description: https://datasheet.ciiva.com/18193/getdatasheetpartid-93202-18193786.pdf?src-supplier=Verical; Supplier Part Number 1: 399-C0805C334K5RAC7800CT-ND
NP13-NP16 = NP
R66 R67 R71 R78-R80 = RMCF0805ZT0R00: as R27 on sheet RoBeast_Driver; Supplier 1: Digikey; Manufacturer Part Number: RMCF0805ZT0R00; RoHS: Yes; Category: Chip SMD Resistors; Stock 1: 1154169; Pricing 1: 1=0.1, 10=0.017, 25=0.0128, 50=0.0096, 100=0.0068, 250=0.00544, 500=0.00436, 1000=0.00321 (USD); Mount: Surface Mount; Number of Pins: 2; Package Shape: Rectangular; Size Code: 0805; Terminal Finish: Nickel; Min Operating Temperature: -55°C; Max Operating Temperature: 155°C; JESD-609 Code: e3; Resistor Type: FIXED RESISTOR; Construction: Rectangular; Package Style: SMTMeter; Packaging: Tape and Reel; Resistance: 0R; Technology: METAL GLAZE/THICK FILM; Termination: Wraparound; Reach SVHC Compliant: Yes; RoHS Compliant: Yes; ComponentLink1URL: https://datasheet.ciiva.com:443/pdfs/VipMasterIC/IC/SEIE/SEIE-S-A0007077258/SEIE-S-A0007077258-1.pdf?src-supplier=IHS+Markit; ComponentLink1Description: https://datasheet.ciiva.com:443/pdfs/VipMasterIC/IC/SEIE/SEIE-S-A0007077258/SEIE-S-A0007077258-1.pdf?src-supplier=IHS+Markit; ComponentLink2URL: https://datasheet.ciiva.com/15193/getdatasheetpartid-360417-15193658.pdf?src-supplier=Verical; ComponentLink2Description: https://datasheet.ciiva.com/15193/getdatasheetpartid-360417-15193658.pdf?src-supplier=Verical; Supplier Part Number 1: RMCF0805ZT0R00CT-ND
U9 = UA78M33CKVURG3: Fixed Positive Standard Regulator, 3.3VBIPolar, PSSO2; Manufacturer: Texas Instruments; Package Body Material: Plastic; Dropout Voltage1-Nom: 2V; Input Voltage Absolute-Max: 35V; Max Input Voltage: 25V; Min Input Voltage: 5.3V; Line Regulation-Max: 0.1%; Number of Functions: 1; Output Current1-Max: 500mA; Output Voltage1-Max: 3.5V; Output Voltage1-Min: 3.1V; Output Voltage1-Nom: 3.3V; Package Equivalence Code: SMSIP3H,.38,90TB; Regulator Type: FIXED POSITIVE SINGLE OUTPUT STANDARD REGULATOR; Voltage Tolerance-Max: 6%; Qualification Status: Not Qualified; Supplier 1: Digikey; Manufacturer Part Number: UA78M33CKVURG3; RoHS: Yes; Category: Voltage Regulators - Linear; Stock 1: 58004; Pricing 1: 1=0.59, 10=0.517, 25=0.4852, 100=0.3961, 250=0.36792, 500=0.31312, 1000=0.2505 (USD); Package Code: TO-252; Number of Pins: 2; Package Shape: Rectangular; Terminal Finish: Tin; JESD-609 Code: e3; Adjustability: FIXED; JESD-30 Code: R-PSSO-G2; Load Regulation-Max: 0.1%; Moisture Sensitivity Level: 3; Number of Outputs: 1; Operating Temperature, TJ-Max: 125°C; Operating Temperature, TJ-Min: 0°C; Package Style: SMALL OUTLINE, HEAT SINK/SLUGMeter; Packaging: Tape and Reel; Peak Reflow Temperature (Cel): 260°C; Surface Mount: Yes; Technology: BIPOLAR; Terminal Form: Gull Wing; Terminal Position: SINGLE; Length: 6.6mm; Width: 6.095mm; Height - Seated (Max): 2.52mm; Terminal Pitch: 2.29mm; Reach SVHC Compliant: Yes; RoHS Compliant: Yes; ComponentLink1URL: https://www.ti.com:443/lit/ds/symlink/ua78m.pdf?src-supplier=IHS+Markit; ComponentLink1Description: https://www.ti.com:443/lit/ds/symlink/ua78m.pdf?src-supplier=IHS+Markit; ComponentLink2URL: https://datasheet.ciiva.com/1512/1882046-1512317.pdf?src-supplier=Element14; ComponentLink2Description: https://datasheet.ciiva.com/1512/1882046-1512317.pdf?src-supplier=Element14; ComponentLink3URL: https://datasheet.ciiva.com/46394/1882046-46394975.pdf?src-supplier=Element14; ComponentLink3Description: https://datasheet.ciiva.com/46394/1882046-46394975.pdf?src-supplier=Element14; ComponentLink4URL: https://datasheet.ciiva.com/2042/ua78m05-2042378.pdf?src-supplier=Digikey; ComponentLink4Description: https://datasheet.ciiva.com/2042/ua78m05-2042378.pdf?src-supplier=Digikey; ComponentLink5URL: https://datasheet.ciiva.com/2042/ua78m05-2042377.pdf?src-supplier=Digikey; ComponentLink5Description: https://datasheet.ciiva.com/2042/ua78m05-2042377.pdf?src-supplier=Digikey; ComponentLink6URL: https://datasheet.ciiva.com/2042/ua78m05-2042376.pdf?src-supplier=Digikey; ComponentLink6Description: https://datasheet.ciiva.com/2042/ua78m05-2042376.pdf?src-supplier=Digikey
U10 = AS78L05RTR-E1: Fixed Positive Standard Regulator, 5VBIPolar; Manufacturer: Diodes; Package Body Material: Plastic; Dropout Voltage1-Nom: 1.8V; Input Voltage Absolute-Max: 36V; Line Regulation-Max: 0.15%; Load Regulation-Max: 0.06%; Number of Outputs: 1; Output Current1-Max: 100mA; Package Equivalence Code: TO-243; Regulator Type: FIXED POSITIVE SINGLE OUTPUT STANDARD REGULATOR; Voltage Tolerance-Max: 5%; Qualification Status: Not Qualified; Supplier 1: Digikey; Manufacturer Part Number: AS78L05RTR-E1; RoHS: Yes; Category: Voltage Regulators - Linear; Stock 1: 132070; Pricing 1: 1=0.39, 10=0.291, 25=0.2628, 100=0.1815, 250=0.15288, 500=0.1242 (USD); Number of Pins: 3; Terminal Finish: Tin; JESD-609 Code: e3; Adjustability: FIXED; Moisture Sensitivity Level: 3; Operating Temperature, TJ-Max: 125°C; Operating Temperature, TJ-Min: -40°C; Output Voltage1-Nom: 5V; Packaging: Tape and Reel; Surface Mount: Yes; Technology: BIPOLAR; Reach SVHC Compliant: Yes; RoHS Compliant: Yes; ComponentLink1URL: https://datasheet.ciiva.com:443/pdfs/VipMasterIC/IC/DIOD/DIODS20236/DIODS20236-1.pdf?src-supplier=IHS+Markit; ComponentLink1Description: https://datasheet.ciiva.com:443/pdfs/VipMasterIC/IC/DIOD/DIODS20236/DIODS20236-1.pdf?src-supplier=IHS+Markit; ComponentLink2URL: https://datasheet.ciiva.com/30016/as78lxx-30016635.pdf?src-supplier=Avnet; ComponentLink2Description: https://datasheet.ciiva.com/30016/as78lxx-30016635.pdf?src-supplier=Avnet